# EAGLE schematic highvoltage (EAGLE 7.7.0)
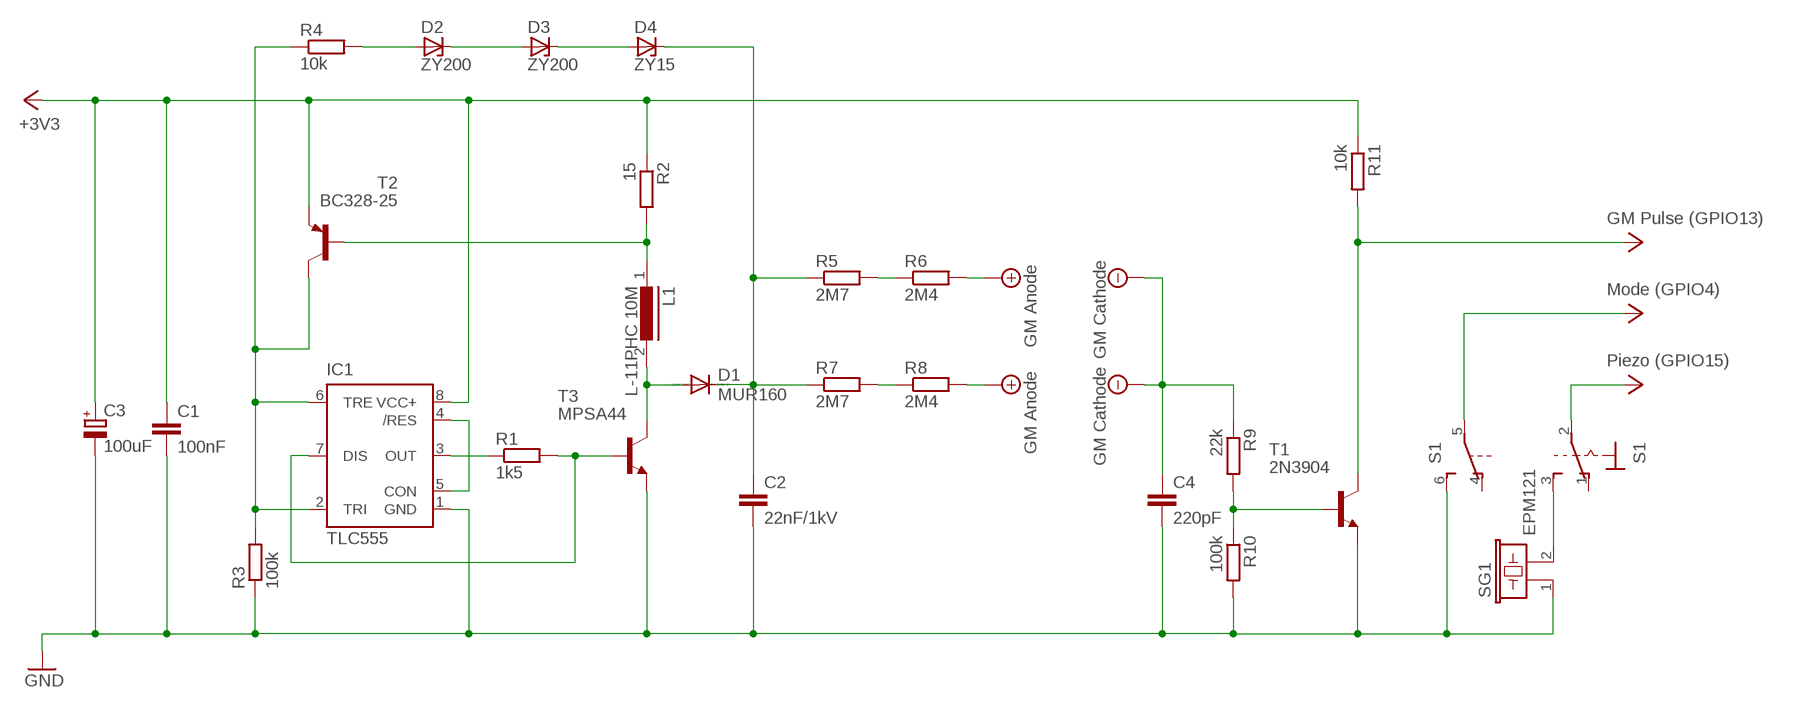
[diagram p0: schematic, sheet 1]

## Parts
C1  100nF  C2.5/2  [C2.5-2]
C2  22nF/1kV  C15/5  [C15B5]
C3  100uF  CPOL-EUE2-5  [E2-5]
C4  220pF  C7.5/3  [C7.5B3]
D1  MUR160  MUR150RL  [DO41-10]
D2  ZY200  ZY  [P1Z12]
D3  ZY200  ZY  [P1Z12]
D4  ZY15  ZDXX  [DO13M]
IC1  TLC555  NE555  [DIL-08]
L1  L-11PHC 10M  82114R  [82114R]
R1  1k5  R-EU_0204/7  [0204/7]
R2  15  R-EU_0204/7  [0204/7]
R3  100k  R-EU_0204/7  [0204/7]
R4  10k  R-EU_0204/7  [0204/7]
R5  2M7  R-EU_0204/7  [0204/7]
R6  2M4  R-EU_0204/7  [0204/7]
R7  2M7  R-EU_0204/7  [0204/7]
R8  2M4  R-EU_0204/7  [0204/7]
R9  22k  R-EU_0204/7  [0204/7]
R10  100k  R-EU_0204/7  [0204/7]
R11  10k  R-EU_0204/7  [0204/7]
S1  320-938  [320-938]
SG1  EPM121  EFBAA40D101  [EFBAA40D101]
T1  2N3904  [TO92]
T2  BC328-25  [TO92-EBC]
T3  MPSA44  MPSA44-NPN-TO92-EBC  [TO92-EBC]

## Nets
+3V3: C1.1 C3.+ IC1.8(VCC+) R2.1 R11.1 R11.2 S1.2(1:P) T1.1(C) T2.E ; supply symbol labelled GM Pulse (GPIO13), Piezo (GPIO15)
+UB: R6.2 R8.2 ; supply symbol labelled GM Anode
-UB: C4.1 R9.1 ; supply symbol labelled GM Cathode
GND: C1.2 C2.2 C3.- C4.2 IC1.1(GND) R3.1 R10.2 S1.6(B:S) SG1.1 T1.3(E) T3.E
N$1: D1.A L1.2 T3.C
N$2: IC1.3(OUT) R1.1
N$3: IC1.7(DIS) R1.2 T3.B
N$4: IC1.4(/RES) IC1.5(CON)
N$5: L1.1 R2.2 T2.B
N$6: IC1.2(TRI) IC1.6(TRE) R3.2 R4.1 T2.C
N$7: S1.3(1:S) SG1.2
N$8: R9.2 R10.1 T1.2(B)
N$10: D2.A R4.2
N$11: D2.C D3.A
N$12: D3.C D4.A
N$13: C2.1 D1.C D4.C R5.1 R7.1
N$14: S1.5(B:P) ; supply symbol labelled Mode (GPIO4)
N$15: R5.2 R6.1
N$16: R7.2 R8.1
Unconnected: S1.1(1:O) S1.4(B:O)

## Library data of the parts
C1 C2 C4 = capacitor-wima:C: CAPACITOR naming: grid - package width
C3 = resistor:CPOL-EU: POLARIZED CAPACITOR, European symbol
D1 = diode:MUR150RL: DIODE
D2 D3 = diode:ZY: Z DIODE
D4 = diode:ZDXX: Z DIODE 1.3 W
IC1 = st-microelectronics:NE555: General purpose bipolar Timer; MF: Arrow Electronics; MPN: NE555N; OC_FARNELL: 1467742; OC_NEWARK: 89K1486
L1 = inductors:82114R: INDUCTOR
R1-R11 = resistor:R-EU_: RESISTOR, European symbol
S1 = switch:320-938: TOGGLE SWITCH distributor RS Components
SG1 = buzzer:EFB?: Piezoelectric Acoustic Transducer Source: Panbasonic .. 2SC1685.pdf; OC_FARNELL: unknown; OC_NEWARK: unknown
T1 = transistor:2N3904: NPN TRANSISTOR
T2 = transistor-pnp:BC328*: PNP Transistror
T3 = transistor:*-NPN-: NPN Transistror BF959 corrected 2008.03.06